# EAGLE schematic Electronics_Design_v1 v5 (EAGLE 9.7.0)
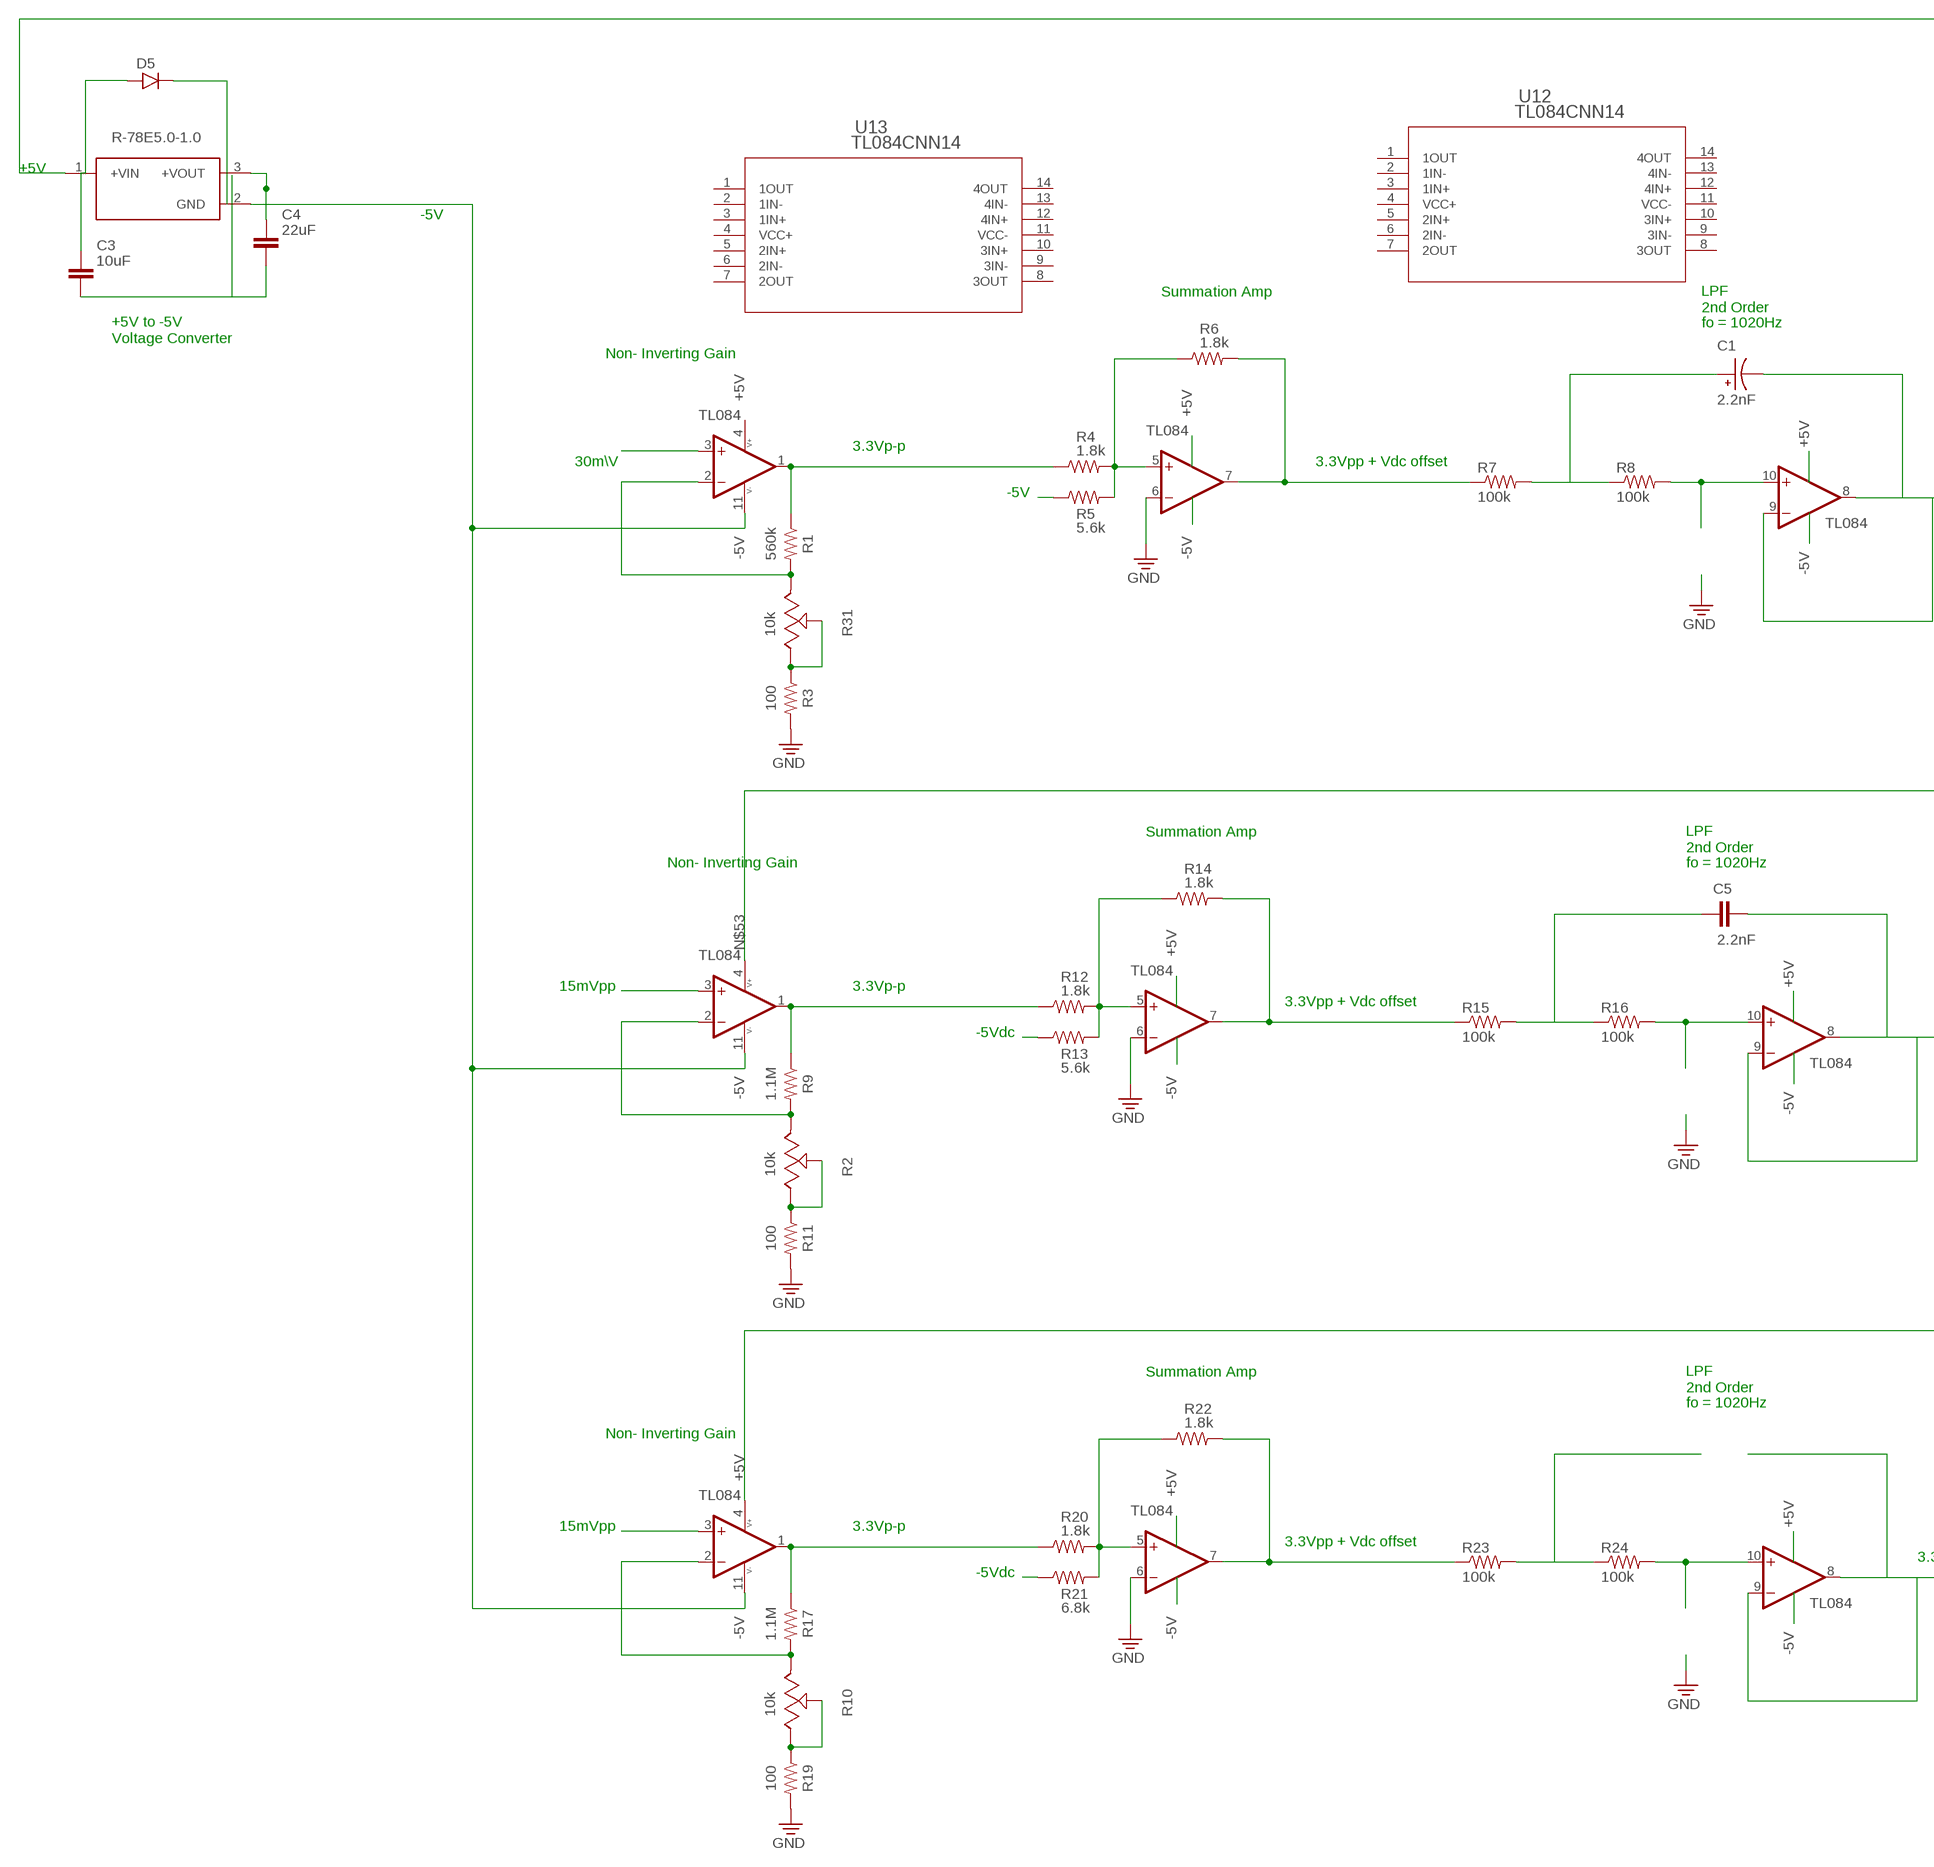
[diagram p0: schematic, sheet 1, part 1 of 2]
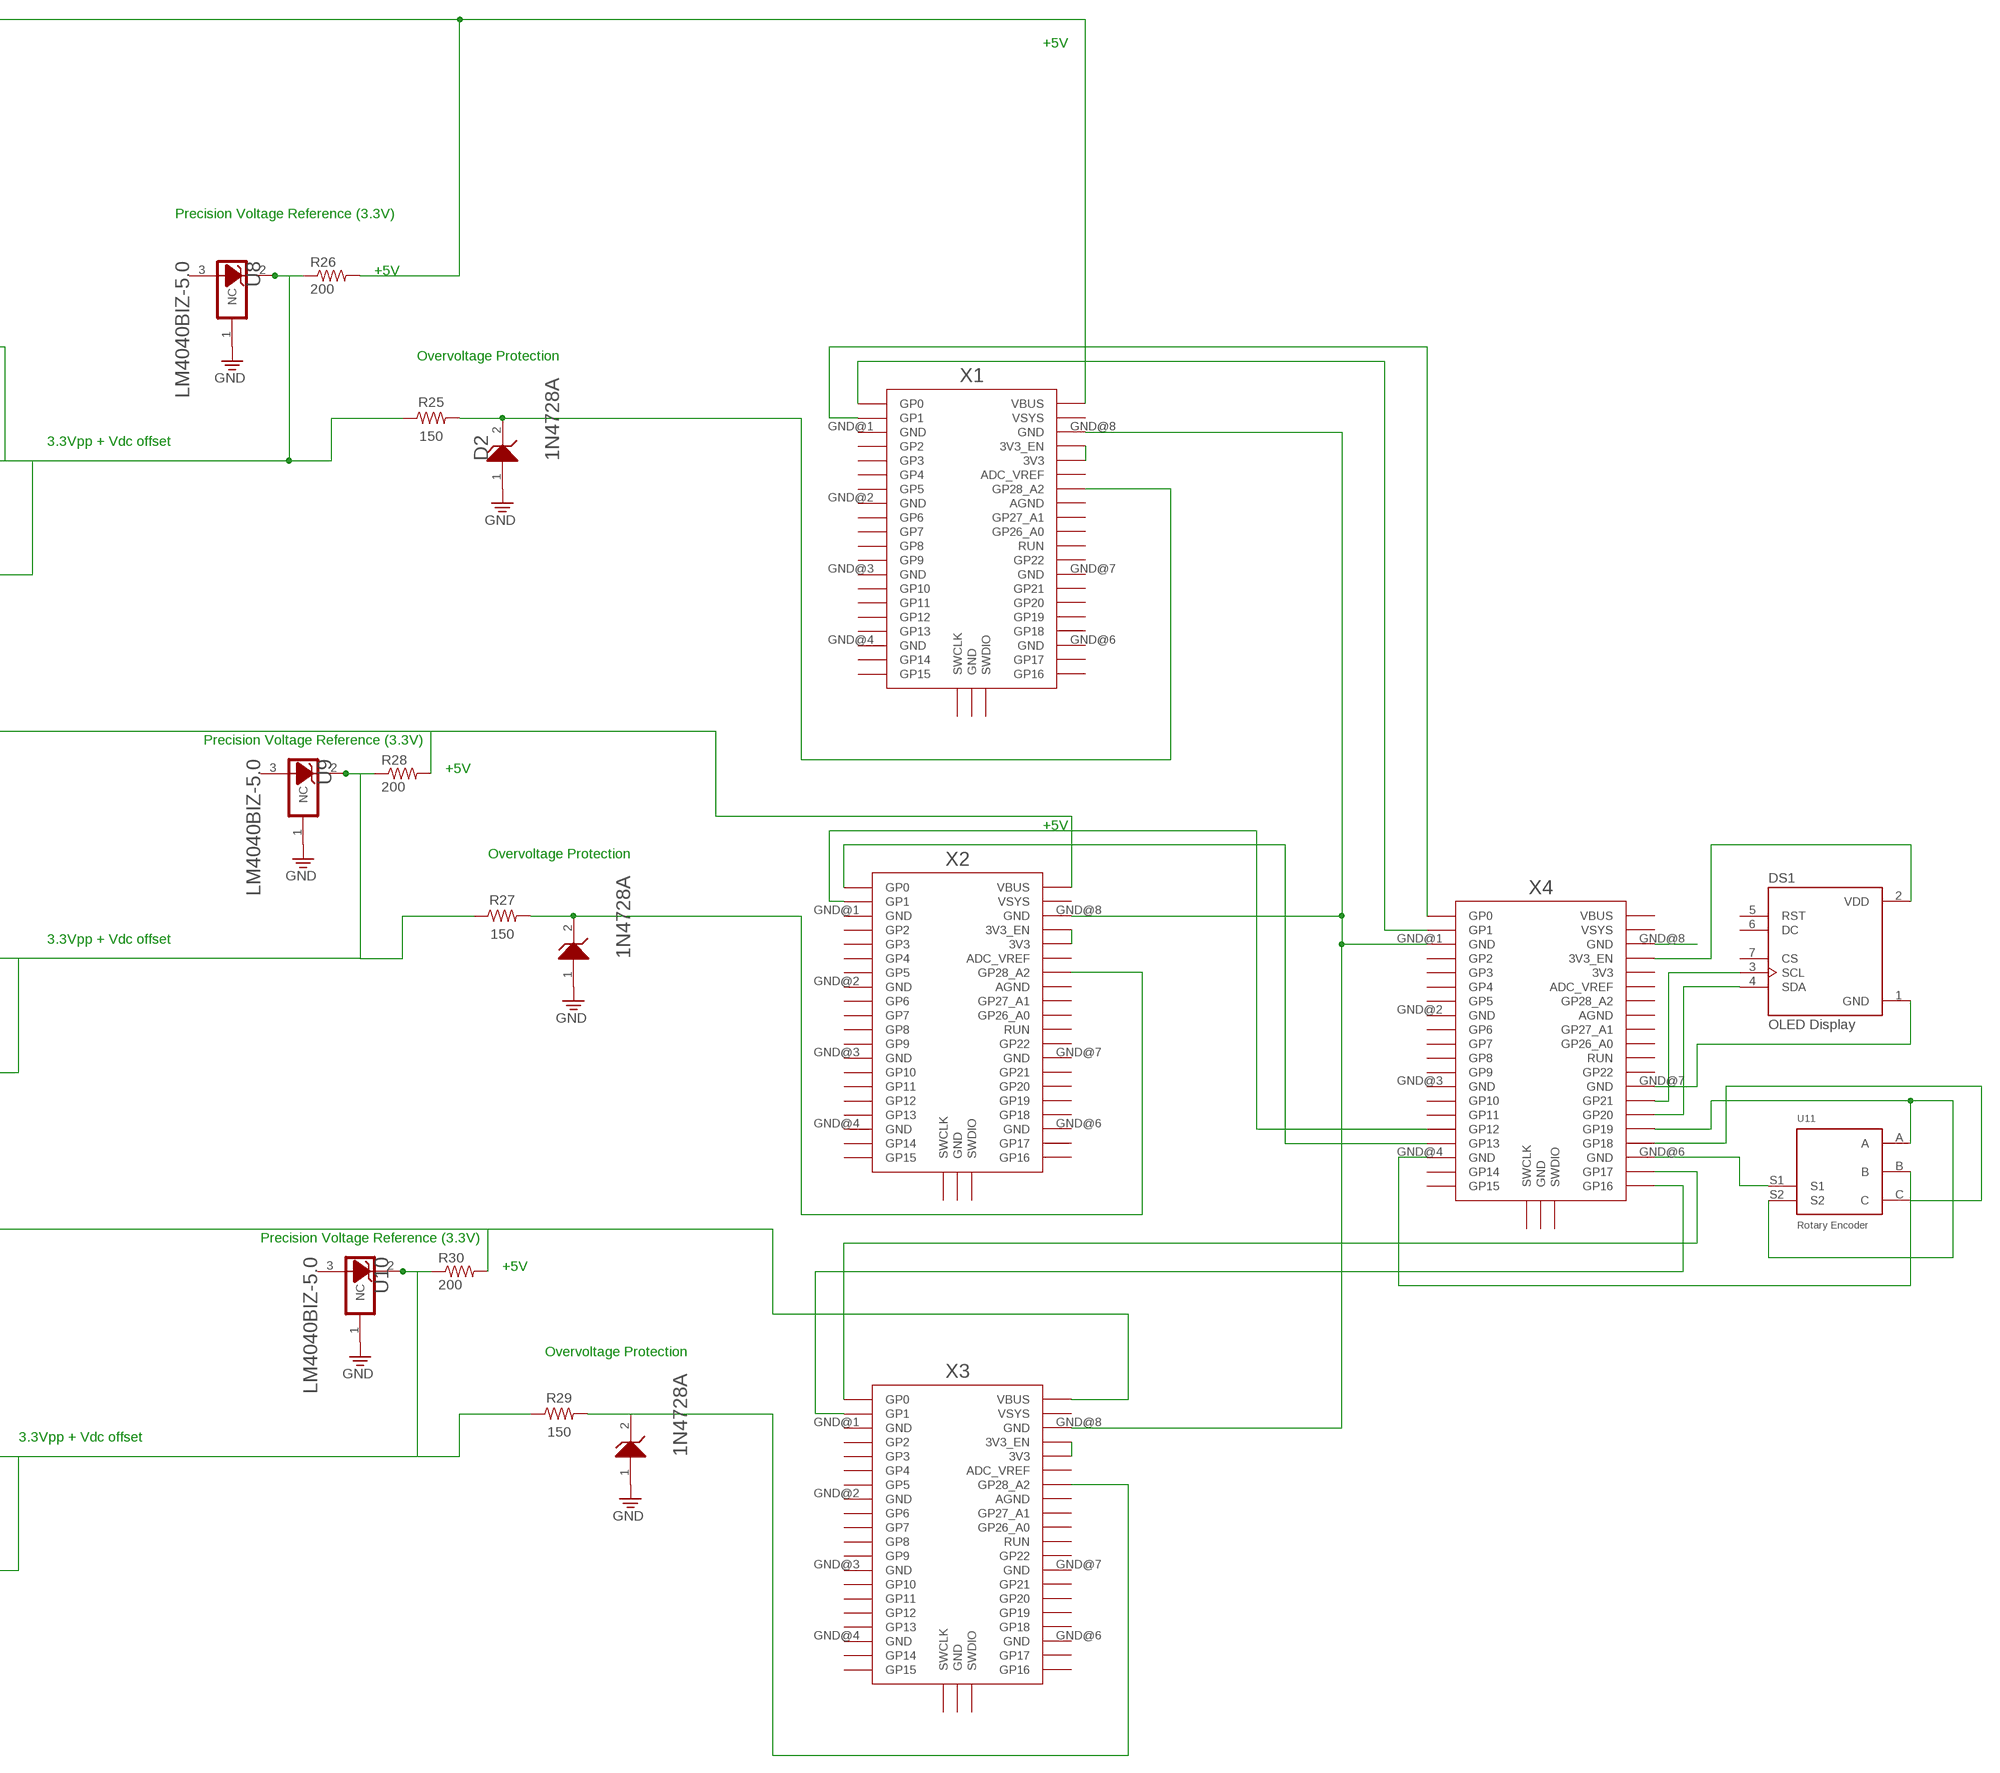
[diagram p1: schematic, sheet 1, part 2 of 2]

## Parts
C1  2.2nF  EEUFC1J101  [CAPPRD500W60D1000H1250]
C3  10uF  C_RADIAL-55.5MM-DIA  [CAPRD2261W240D5080H5555B]
C4  22uF  C_RADIAL-55.5MM-DIA  [CAPRD2261W240D5080H5555B]
C5  2.2nF  C_RADIAL-55.5MM-DIA  [CAPRD2261W240D5080H5555B]
D2  FAIRCHILD_SEMICONDUCTOR_1N4728AFAIRCHILD_SEMICONDUCTOR_1N4728A_0_0  [FAIRCHILD_SEMICONDUCTOR_1N4728A_0]
D3  FAIRCHILD_SEMICONDUCTOR_1N4728AFAIRCHILD_SEMICONDUCTOR_1N4728A_0_0  [FAIRCHILD_SEMICONDUCTOR_1N4728A_0]
D4  FAIRCHILD_SEMICONDUCTOR_1N4728AFAIRCHILD_SEMICONDUCTOR_1N4728A_0_0  [FAIRCHILD_SEMICONDUCTOR_1N4728A_0]
D5  1N914.4  [DO35-4]
DS1  OLED Display  AOM12864A0-1.54WW-ANO  [LCD_AOM12864A0-1.54WW-ANO]
PS1  R-78E5.0-1.0  [CONV_R-78E5.0-1.0]
R1  560k  R-US_AXIAL-7.2MM-PITCH  [RESAD724W46L381D178B]
R2  10k  3310Y-001-104L  [3310Y-001-104L-ND]
R3  100  R-US_AXIAL-7.2MM-PITCH  [RESAD724W46L381D178B]
R4  1.8k  R-US_AXIAL-7.2MM-PITCH  [RESAD724W46L381D178B]
R5  5.6k  R-US_AXIAL-7.2MM-PITCH  [RESAD724W46L381D178B]
R6  1.8k  R-US_AXIAL-7.2MM-PITCH  [RESAD724W46L381D178B]
R7  100k  R-US_AXIAL-7.2MM-PITCH  [RESAD724W46L381D178B]
R8  100k  R-US_AXIAL-7.2MM-PITCH  [RESAD724W46L381D178B]
R9  1.1M  R-US_AXIAL-7.2MM-PITCH  [RESAD724W46L381D178B]
R10  10k  3310Y-001-104L  [3310Y-001-104L-ND]
R11  100  R-US_AXIAL-7.2MM-PITCH  [RESAD724W46L381D178B]
R12  1.8k  R-US_AXIAL-7.2MM-PITCH  [RESAD724W46L381D178B]
R13  5.6k  R-US_AXIAL-7.2MM-PITCH  [RESAD724W46L381D178B]
R14  1.8k  R-US_AXIAL-7.2MM-PITCH  [RESAD724W46L381D178B]
R15  100k  R-US_AXIAL-7.2MM-PITCH  [RESAD724W46L381D178B]
R16  100k  R-US_AXIAL-7.2MM-PITCH  [RESAD724W46L381D178B]
R17  1.1M  R-US_AXIAL-7.2MM-PITCH  [RESAD724W46L381D178B]
R19  100  R-US_AXIAL-7.2MM-PITCH  [RESAD724W46L381D178B]
R20  1.8k  R-US_AXIAL-7.2MM-PITCH  [RESAD724W46L381D178B]
R21  6.8k  R-US_AXIAL-7.2MM-PITCH  [RESAD724W46L381D178B]
R22  1.8k  R-US_AXIAL-7.2MM-PITCH  [RESAD724W46L381D178B]
R23  100k  R-US_AXIAL-7.2MM-PITCH  [RESAD724W46L381D178B]
R24  100k  R-US_AXIAL-7.2MM-PITCH  [RESAD724W46L381D178B]
R25  150  R-US_AXIAL-7.2MM-PITCH  [RESAD724W46L381D178B]
R26  200  R-US_AXIAL-7.2MM-PITCH  [RESAD724W46L381D178B]
R27  150  R-US_AXIAL-7.2MM-PITCH  [RESAD724W46L381D178B]
R28  200  R-US_AXIAL-7.2MM-PITCH  [RESAD724W46L381D178B]
R29  150  R-US_AXIAL-7.2MM-PITCH  [RESAD724W46L381D178B]
R30  200  R-US_AXIAL-7.2MM-PITCH  [RESAD724W46L381D178B]
R31  10k  3310Y-001-104L  [3310Y-001-104L-ND]
U1  TL084  [SOP65P640X120-14N]
U2  TL084  [SOP65P640X120-14N]
U3  TL084  [SOP65P640X120-14N]
U4  TL084  [SOP65P640X120-14N]
U5  TL084  [SOP65P640X120-14N]
U6  TL084  [SOP65P640X120-14N]
U7  TL084  [SOP65P640X120-14N]
U8  TI_NATIONAL_SEMICONDUCTOR_LM4040BIZ-5.0TI_NATIONAL_SEMICONDUCTOR_LM4040BIZ-5.0_0_0  [TI_NATIONAL_SEMICONDUCTOR_LM4040BIZ-5.0_0]
U9  TI_NATIONAL_SEMICONDUCTOR_LM4040BIZ-5.0TI_NATIONAL_SEMICONDUCTOR_LM4040BIZ-5.0_0_0  [TI_NATIONAL_SEMICONDUCTOR_LM4040BIZ-5.0_0]
U10  TI_NATIONAL_SEMICONDUCTOR_LM4040BIZ-5.0TI_NATIONAL_SEMICONDUCTOR_LM4040BIZ-5.0_0_0  [TI_NATIONAL_SEMICONDUCTOR_LM4040BIZ-5.0_0]
U11  Rotary Encoder  ACZ11BR1E-20FD1-20C  [CUI_ACZ11BR1E-20FD1-20C]
U12  TL084CNN14  [N14]
U13  TL084CNN14  [N14]
X1  Piico Pi  RPI_PICO_IG-TH  [RPI_PICO_TH]
X2  RPI_PICO_IG-TH  [RPI_PICO_TH]
X3  RPI_PICO_IG-TH  [RPI_PICO_TH]
X4  RPI_PICO_IG-TH  [RPI_PICO_TH]

## Nets
+5V: PS1.1(+VIN) R26.2 U5.4(VCC+) X1.VBUS
+IN1: U1.3(+IN1)
+IN2: U2.3(+IN1)
+IN3: U5.3(+IN1)
-5V: PS1.2(GND) U1.11(VCC-) U2.11(VCC-) U5.11(VCC-)
-IN1: R1.2 R31.1 U1.2(-IN1)
-IN2: R2.1 R9.2 U2.2(-IN1)
-IN3: R10.1 R17.2 U5.2(-IN1)
GND: D2.1(A) D3.1(A) D4.1(A) R3.2 R11.2 R19.2 U1.6(-IN2) U3.6(-IN2) U6.6(-IN2) U8.1(NC) U9.1(NC) U10.1(NC)
N$1: R4.2 R5.2 R6.1 U1.5(+IN2)
N$2: R3.1 R31.2 R31.3
N$3: R1.1 R4.1 U1.1(OUT1)
N$4: R5.1
N$5: R6.2 R7.1 U1.7(OUT2)
N$8: C1.P R7.2 R8.1
N$9: R8.2 U1.10(+IN3)
N$10: C1.N
N$11: U1.9(-IN3)
N$12: X2.3V3 X2.3V3_EN
N$15: C3.1 D5.A
N$16: C4.2
N$17: D5.C
N$18: C3.2
N$19: C4.1 PS1.3(+VOUT)
N$20: R2.2 R2.3 R11.1
N$21: R10.2 R10.3 R19.1
N$22: R9.1 R12.1 U2.1(OUT1)
N$23: R12.2 R13.2 R14.1 U3.5(+IN2)
N$24: R13.1
N$25: R14.2 R15.1 U3.7(OUT2)
N$28: C5.1 R15.2 R16.1
N$29: R16.2 U4.10(+IN3)
N$30: C5.2
N$31: U4.9(-IN3)
N$32: X3.3V3 X3.3V3_EN
N$35: R17.1 R20.1 U5.1(OUT1)
N$36: R20.2 R21.2 R22.1 U6.5(+IN2)
N$37: R21.1
N$38: R22.2 R23.1 U6.7(OUT2)
N$41: R23.2 R24.1
N$42: R24.2 U7.10(+IN3)
N$44: U7.9(-IN3)
N$45: R29.1 R30.1 U7.8(OUT3) U10.2(+V)
N$48: D2.2(K) R25.2 X1.GP28_A2
N$49: R25.1 R26.1 U1.8(OUT3) U8.2(+V)
N$50: X1.3V3 X1.3V3_EN
N$51: D3.2(K) R27.2 X2.GP28_A2
N$52: R27.1 R28.1 U4.8(OUT3) U9.2(+V)
N$53: R28.2 U2.4(VCC+) X2.VBUS
N$54: D4.2(K) R29.2 X3.GP28_A2
N$55: X1.GP0 X4.GP1
N$56: R30.2 X3.VBUS
N$57: X1.GP1 X4.GP0
N$58: X1.GND@8(GND) X2.GND@8(GND) X3.GND@8(GND) X4.GND@1(GND)
N$59: X2.GP0 X4.GP13
N$60: X2.GP1 X4.GP12
N$61: X3.GP0 X4.GP17
N$62: X3.GP1 X4.GP16
N$63: U11.S1 X4.GND@6(GND)
N$64: U11.A U11.S2 X4.GP19
N$65: U11.C X4.GP18
N$66: U11.B X4.GND@4(GND)
N$67: DS1.2(VDD) X4.3V3_EN
N$68: DS1.1(GND) X4.GND@7(GND)
N$69: DS1.4(SDA) X4.GP20
N$70: DS1.3(SCL) X4.GP21
N$71: X4.GND@8(GND)
Unconnected: DS1.5(RST) DS1.6(DC) DS1.7(CS) U1.12(+IN4) U1.13(-IN4) U1.14(OUT4) U2.5(+IN2) U2.6(-IN2) U2.7(OUT2) U2.8(OUT3) U2.9(-IN3) U2.10(+IN3) U2.12(+IN4) U2.13(-IN4) U2.14(OUT4) U3.1(OUT1) U3.2(-IN1) U3.3(+IN1) U3.8(OUT3) U3.9(-IN3) U3.10(+IN3) U3.12(+IN4) U3.13(-IN4) U3.14(OUT4) U4.1(OUT1) U4.2(-IN1) U4.3(+IN1) U4.5(+IN2) U4.6(-IN2) U4.7(OUT2) U4.12(+IN4) U4.13(-IN4) U4.14(OUT4) U5.5(+IN2) U5.6(-IN2) U5.7(OUT2) U5.8(OUT3) U5.9(-IN3) U5.10(+IN3) U5.12(+IN4) U5.13(-IN4) U5.14(OUT4) U6.1(OUT1) U6.2(-IN1) U6.3(+IN1) U6.8(OUT3) U6.9(-IN3) U6.10(+IN3) U6.12(+IN4) U6.13(-IN4) U6.14(OUT4) U7.1(OUT1) U7.2(-IN1) U7.3(+IN1) U7.5(+IN2) U7.6(-IN2) U7.7(OUT2) U7.12(+IN4) U7.13(-IN4) U7.14(OUT4) U8.3(-V) U9.3(-V) U10.3(-V) U12.1(1OUT) U12.2(1IN-) U12.3(1IN+) U12.5(2IN+) U12.6(2IN-) U12.7(2OUT) U12.8(3OUT) U12.9(3IN-) U12.10(3IN+) U12.12(4IN+) U12.13(4IN-) U12.14(4OUT) U13.1(1OUT) U13.2(1IN-) U13.3(1IN+) U13.5(2IN+) U13.6(2IN-) U13.7(2OUT) U13.8(3OUT) U13.9(3IN-) U13.10(3IN+) U13.12(4IN+) U13.13(4IN-) U13.14(4OUT) X1.ADC_VREF X1.AGND X1.GND@1(GND) X1.GND@2(GND) X1.GND@3(GND) X1.GND@4(GND) X1.GND@5(GND) X1.GND@6(GND) X1.GND@7(GND) X1.GP2 X1.GP3 X1.GP4 X1.GP5 X1.GP6 X1.GP7 X1.GP8 X1.GP9 X1.GP10 X1.GP11 X1.GP12 X1.GP13 X1.GP14 X1.GP15 X1.GP16 X1.GP17 X1.GP18 X1.GP19 X1.GP20 X1.GP21 X1.GP22 X1.GP26_A0 X1.GP27_A1 X1.RUN X1.SWCLK X1.SWDIO X1.VSYS X2.ADC_VREF X2.AGND X2.GND@1(GND) X2.GND@2(GND) X2.GND@3(GND) X2.GND@4(GND) X2.GND@5(GND) X2.GND@6(GND) X2.GND@7(GND) X2.GP2 X2.GP3 X2.GP4 X2.GP5 X2.GP6 X2.GP7 X2.GP8 X2.GP9 X2.GP10 X2.GP11 X2.GP12 X2.GP13 X2.GP14 X2.GP15 X2.GP16 X2.GP17 X2.GP18 X2.GP19 X2.GP20 X2.GP21 X2.GP22 X2.GP26_A0 X2.GP27_A1 X2.RUN X2.SWCLK X2.SWDIO X2.VSYS X3.ADC_VREF X3.AGND X3.GND@1(GND) X3.GND@2(GND) X3.GND@3(GND) X3.GND@4(GND) X3.GND@5(GND) X3.GND@6(GND) X3.GND@7(GND) X3.GP2 X3.GP3 X3.GP4 X3.GP5 X3.GP6 X3.GP7 X3.GP8 X3.GP9 X3.GP10 X3.GP11 X3.GP12 X3.GP13 X3.GP14 X3.GP15 X3.GP16 X3.GP17 X3.GP18 X3.GP19 X3.GP20 X3.GP21 X3.GP22 X3.GP26_A0 X3.GP27_A1 X3.RUN X3.SWCLK X3.SWDIO X3.VSYS X4.3V3 X4.ADC_VREF X4.AGND X4.GND@2(GND) X4.GND@3(GND) X4.GND@5(GND) X4.GP2 X4.GP3 X4.GP4 X4.GP5 X4.GP6 X4.GP7 X4.GP8 X4.GP9 X4.GP10 X4.GP11 X4.GP14 X4.GP15 X4.GP22 X4.GP26_A0 X4.GP27_A1 X4.GP28_A2 X4.RUN X4.SWCLK X4.SWDIO X4.VBUS X4.VSYS

## Buses
B$1
B$2

## Notes on the sheet
- +5V
- +5V
- -5V
- Precision Voltage Reference (3.3V)
- Summation Amp | +5V
- LPF
  2nd Order
- fo = 1020Hz
- +5V to -5V
  Voltage Converter
- Non- Inverting Gain
- Overvoltage Protection
- 3.3Vp-p
- 30m\V | 3.3Vpp + Vdc offset
- 3.3Vpp + Vdc offset
- -5V
- Precision Voltage Reference (3.3V)
- Summation Amp | +5V
- LPF
  2nd Order
- Non- Inverting Gain | fo = 1020Hz
- +5V
- Overvoltage Protection
- 15mVpp | 3.3Vp-p
- 3.3Vpp + Vdc offset
- 3.3Vpp + Vdc offset
- -5Vdc
- Precision Voltage Reference (3.3V)
- Summation Amp | +5V
- LPF
  2nd Order
- fo = 1020Hz
- Non- Inverting Gain
- Overvoltage Protection
- 15mVpp | 3.3Vp-p
- 3.3Vpp + Vdc offset
- 3.3Vpp + Vdc offset
- -5Vdc

## Power pins joined to a net without a drawn wire
VCC+: U1.4(VCC+) U3.4(VCC+) U4.4(VCC+) U6.4(VCC+) U7.4(VCC+) U12.4(VCC+) U13.4(VCC+)
VCC-: U3.11(VCC-) U4.11(VCC-) U6.11(VCC-) U7.11(VCC-) U12.11(VCC-) U13.11(VCC-)

## Library data of the parts
C1 = EEUFC1J101:EEUFC1J101: FC-A; A_MAX: 12.5; B_MAX: 0.65; B_NOM: 0.6; DESCRIPTION: FC-A; D_NOM: 10; E_NOM: 5; MF: PANASONIC; PARTREV: 20-DEC-19
C3-C5 = Capacitor:C: Capacitor - Generic; CATEGORY: Capacitor
D2-D4 = Fairchild Semiconductor - 1N4728A:FAIRCHILD_SEMICONDUCTOR_1N4728A: FAIR-DZEN-A1K2-2; COMPONENT_LINK_1_DESCRIPTION: Manufacturer URL; COMPONENT_LINK_1_URL: http://www.fairchildsemi.com/; COMPONENT_LINK_3_DESCRIPTION: Package Specification; COMPONENT_LINK_3_URL: http://www.fairchildsemi.com/dwg/DO/DO41A.pdf; DATASHEET: http://www.fairchildsemi.com/ds/1N/1N4744A.pdf; DATASHEET_VERSION: Rev. H3; FOOTPRINT_VARIANT_NAME_0: Manufacturer Recommended; IMPORTED: yes; IMPORTED_FROM: vault; IMPORT_TS: 1521843604; IR_UA: 100; MF: Fairchild Semiconductor; MOUNTING_TECHNOLOGY: Through Hole; MPN: 1N4728A; OPERATING_AND_STORAGE_TEMPERATURE_RANGE: -65 to 200 degC; PACKAGE: DO-41-2; PACKAGE_DESCRIPTION: 2-Pin Axial leaded, Body 2.72 x 5.2 mm, Lead Spread 25.4 mm; PACKAGE_VERSION: Rev. 2; PD_W: 1; PREFIX: D; RELEASE_DATE: 1396598095; ROHS: Yes; TEST_CURRENT_IZ_MA: 76; TOLERANCE: 5%; VAULT_GUID: BB5BB100-3A3D-49B5-B4BA-51B09125605A; VAULT_REVISION: 7D3D7113-8068-4E65-AD6A-1728C093E95D; VZ_MAX_V: 3.465; VZ_MIN_V: 3.135; ZZ_MAX_OHM: 10
D5 = 1N914:1N914: Fast Switching Diode DO-35 glass case a.k.a. 1N4148
DS1 = AOM12864A0-1.54WW-ANO:AOM12864A0-1.54WW-ANO: Non-Touch Graphic LCD Display Module - White OLED SPI 1.54in (39.12mm) 128 x 64; MANUFACTURER: Orient Display; MAXIMUM_PACKAGE_HEIGHT: 5.5mm; PARTREV: O; STANDARD: Manufacturer Recommendations
PS1 = R-78E5.0-1.0:R-78E5.0-1.0: 1.0 Amp SIP3 Single Output; MANUFACTURER: RECOM; MAXIMUM_PACKAGE_HEIGHT: 10.40mm; PARTREV: 6; STANDARD: Manufacturer Recommendations
R1 R3 R9 R11 R17 R19 R25 R27 R29 = Resistor:R-US: Resistor Fixed - ANSI; CATEGORY: Resistor; SUB-CATEGORY: Fixed
R2 R10 R31 = Potentiometer_Trimmers:3310Y-001-104L: POT 100K OHM 1/4W PLASTIC LINEAR Manufacturer's datasheet <https://www.bourns.com/docs/Product-Datasheets/3310.pdf>; CREATED_BY: PCBLayout.com; DIGIKEY_PARTNO: 3310Y-001-104L-ND; MANUFACTURER: Bourns Inc.; MPN: 3310Y-001-104L
R4-R8 R12-R16 R20-R24 R26 R28 R30 = Tutorial - Fusion 360:R-US: Resistor Fixed - ANSI; CATEGORY: Resistor; SUB-CATEGORY: Fixed
U1-U7 = TL084:TL084: GENERAL PURPOSE J-FET QUAD OPERATIONAL AMPLIFIERS; A1_MIN: 0.15; A_MAX: 1.2; A_MIN: 1.2; A_NOM: 1.2; B_MAX: 0.3; B_MIN: 0.19; B_NOM: 0.245; D2_MAX: 0.0; D_MAX: 5.1; D_MIN: 4.9; D_NOM: 5.0; E1_MAX: 4.5; E1_MIN: 4.3; E1_NOM: 4.4; E2_MAX: 0.0; ENOM: 0.65; E_MAX: 6.4; E_MIN: 6.4; E_NOM: 6.4; L_MAX: 0.75; L_MIN: 0.5; L_NOM: 0.625; MANUFACTURER: Texas Instruments; MAXIMUM_PACKAGE_HEIGHT: 1.2mm; PIN_COUNT: 14.0; STANDARD: IPC 7351B
U8-U10 = TI National Semiconductor - LM4040BIZ-5.0:TI_NATIONAL_SEMICONDUCTOR_LM4040BIZ-5.0: PM-REF-LM113-IL3A; CODE__JEDEC: TO-226-AA; COMPONENT_LINK_1_DESCRIPTION: LM4040 Datasheet; COMPONENT_LINK_1_URL: http://www.national.com/ds/LM/LM4040.pdf; COMPONENT_LINK_2_DESCRIPTION: LM4040 Web Page; COMPONENT_LINK_2_URL: http://www.national.com/pf/LM/LM4040.html; COMPONENT_LINK_3_DESCRIPTION: Z03A Package Page; COMPONENT_LINK_3_URL: http://www.national.com/packaging/folders/z03a.html; COMP_TYPE: Voltage Reference IC; DATASHEET_VERSION: Apr-2005; IMPORTED: yes; IMPORTED_FROM: vault; IMPORT_TS: 1521180609; MF: TI National Semiconductor; MPN: LM4040BIZ-5.0; PACKAGE: Z03A; PACKAGE_DESCRIPTION: TO-92, Molded, 3 Lead; PACKAGE_TOP_MARKING: NSXYTT*4040B*IZ5.0; PACKAGE_VERSION: revG, Sep-2000; PIN_COUNT: 3; POWER_WISE: N; PREFIX: U; ROHS: No; VAULT_GUID: CCAAE809-EA0A-4F87-952E-8A300FF63A12; VAULT_REVISION: 709C3BE3-EA26-41DE-880D-F4C7CBE28450
U11 = ACZ11BR1E-20FD1-20C:ACZ11BR1E-20FD1-20C: 11 mm, 12 ~ 20 PPR, Through Hole, Mechanical Panel Mount Encoder; MANUFACTURER: CUI Devices; MAXIMUM_PACKAGE_HEIGHT: 26.5mm; PARTREV: 1.02; STANDARD: Manufacturer Recommendations
U12 U13 = 2023-02-17_00-49-57_Library:TL084CN; COPYRIGHT: Copyright (C) 2023 Ultra Librarian. All rights reserved.; MANUFACTURER_PART_NUMBER: TL084CN; MFR_NAME: Texas Instruments
X1-X4 = RaspberryPi_Pico:RPI_PICO_IG